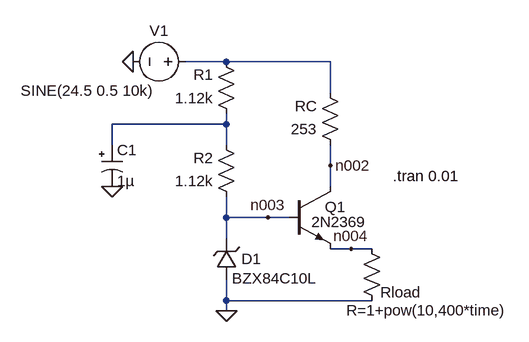
[diagram p0: schematic c02fig22.asc]
c02fig22.asc, the LTspice schematic file:
Version 4
SHEET 1 1068 680
WIRE 240 -96 176 -96
WIRE 400 -96 240 -96
WIRE 400 -48 400 -96
WIRE 240 0 240 -16
WIRE 240 0 64 0
WIRE 64 32 64 0
WIRE 240 32 240 0
WIRE 400 64 400 32
WIRE 400 96 400 64
WIRE 240 144 240 112
WIRE 304 144 240 144
WIRE 336 144 304 144
WIRE 240 176 240 144
WIRE 432 192 400 192
WIRE 464 192 432 192
WIRE 240 272 240 240
WIRE 464 272 240 272
WIRE 240 288 240 272
FLAG 96 -96 0
FLAG 240 288 0
FLAG 304 144 n003
FLAG 432 192 n004
FLAG 400 64 n002
FLAG 64 96 0
SYMBOL voltage 192 -96 R90
WINDOW 0 -32 56 VBottom 2
WINDOW 3 29 166 VTop 2
WINDOW 123 0 0 Left 0
WINDOW 39 0 0 Left 0
SYMATTR InstName V1
SYMATTR Value SINE(24.5 0.5 10k)
SYMBOL res 256 0 R180
WINDOW 0 36 76 Left 2
WINDOW 3 36 40 Left 2
SYMATTR InstName R1
SYMATTR Value 1.12k
SYMBOL res 448 176 R0
WINDOW 0 29 83 Left 2
WINDOW 3 -23 111 Left 2
SYMATTR InstName Rload
SYMATTR Value R=1+pow(10,400*time)
SYMBOL npn 336 96 R0
WINDOW 3 35 55 Left 2
SYMATTR Value 2N2369
SYMATTR InstName Q1
SYMBOL zener 256 240 R180
WINDOW 0 -38 32 Left 2
WINDOW 3 -124 2 Left 2
SYMATTR InstName D1
SYMATTR Value BZX84C10L
SYMBOL res 416 48 R180
WINDOW 0 36 76 Left 2
WINDOW 3 36 40 Left 2
SYMATTR InstName RC
SYMATTR Value 253
SYMBOL res 256 128 R180
WINDOW 0 36 76 Left 2
WINDOW 3 36 40 Left 2
SYMATTR InstName R2
SYMATTR Value 1.12k
SYMBOL polcap 48 32 R0
WINDOW 3 24 56 Left 2
SYMATTR InstName C1
SYMATTR Value 1µ
SYMATTR Description Capacitor
SYMATTR Type cap
SYMATTR SpiceLine V=25 Irms=420m Rser=0.193 Lser=1.7n
TEXT 496 80 Left 2 !.tran 0.01

The netlist it stands for:
* c02fig22.asc
V1 N001 0 SINE(24.5 0.5 10k)
R1 N005 N001 1.12k
Rload n004 0 R=1+pow(10,400*time)
Q1 n002 n003 n004 0 2N2369
D1 0 n003 BZX84C10L
RC n002 N001 253
R2 n003 N005 1.12k
C1 N005 0 1µ V=25 Irms=420m Rser=0.193 Lser=1.7n
.model D D
.lib standard.dio
.model NPN NPN
.model PNP PNP
.lib standard.bjt
.tran 0.01
.backanno
.end